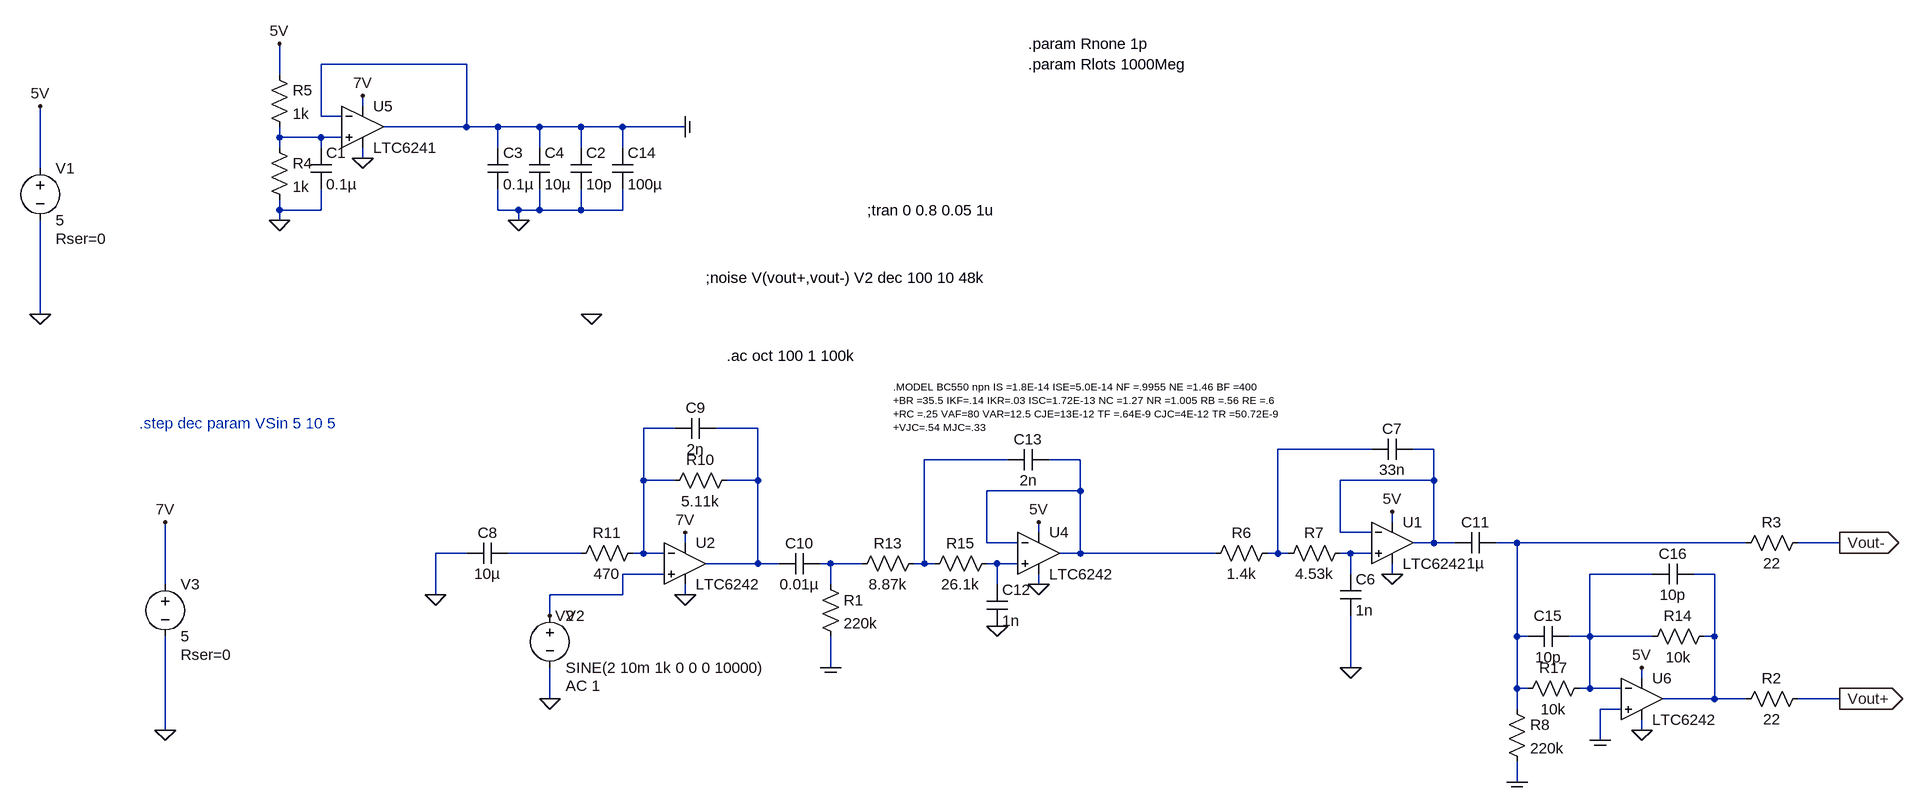
[diagram p0: schematic preampsimplified.asc]
preampsimplified.asc, the LTspice schematic file:
Version 4
SHEET 1 2944 1584
WIRE -192 -384 -416 -384
WIRE -480 -368 -480 -416
WIRE -352 -320 -352 -336
WIRE -416 -304 -416 -384
WIRE -384 -304 -416 -304
WIRE -192 -288 -192 -384
WIRE -192 -288 -320 -288
WIRE -144 -288 -192 -288
WIRE -80 -288 -144 -288
WIRE -16 -288 -80 -288
WIRE 48 -288 -16 -288
WIRE 144 -288 48 -288
WIRE -480 -272 -480 -288
WIRE -416 -272 -480 -272
WIRE -384 -272 -416 -272
WIRE -480 -256 -480 -272
WIRE -416 -256 -416 -272
WIRE -144 -256 -144 -288
WIRE -80 -256 -80 -288
WIRE -16 -256 -16 -288
WIRE 48 -256 48 -288
WIRE -352 -240 -352 -256
WIRE -848 -224 -848 -320
WIRE -480 -160 -480 -176
WIRE -416 -160 -416 -192
WIRE -416 -160 -480 -160
WIRE -144 -160 -144 -192
WIRE -112 -160 -144 -160
WIRE -80 -160 -80 -192
WIRE -80 -160 -112 -160
WIRE -16 -160 -16 -192
WIRE -16 -160 -80 -160
WIRE 48 -160 48 -192
WIRE 48 -160 -16 -160
WIRE -480 -144 -480 -160
WIRE -112 -144 -112 -160
WIRE -848 0 -848 -144
WIRE 128 176 80 176
WIRE 256 176 192 176
WIRE 1200 208 1056 208
WIRE 1296 208 1264 208
WIRE 640 224 512 224
WIRE 752 224 704 224
WIRE 80 256 80 176
WIRE 128 256 80 256
WIRE 256 256 256 176
WIRE 256 256 208 256
WIRE 1296 256 1296 208
WIRE 1296 256 1152 256
WIRE 752 272 752 224
WIRE 752 272 608 272
WIRE 1232 320 1232 304
WIRE 688 336 688 320
WIRE 1152 336 1152 256
WIRE 1200 336 1152 336
WIRE 144 352 144 336
WIRE 608 352 608 272
WIRE 656 352 608 352
WIRE 1296 352 1296 256
WIRE 1296 352 1264 352
WIRE 1328 352 1296 352
WIRE 1424 352 1392 352
WIRE 1776 352 1424 352
WIRE 1920 352 1856 352
WIRE -192 368 -240 368
WIRE -16 368 -128 368
WIRE 80 368 80 256
WIRE 80 368 64 368
WIRE 112 368 80 368
WIRE 752 368 752 272
WIRE 752 368 720 368
WIRE 960 368 752 368
WIRE 1056 368 1056 208
WIRE 1056 368 1040 368
WIRE 1072 368 1056 368
WIRE 1168 368 1152 368
WIRE 1200 368 1168 368
WIRE 256 384 256 256
WIRE 256 384 176 384
WIRE 288 384 256 384
WIRE 368 384 352 384
WIRE 416 384 368 384
WIRE 512 384 512 224
WIRE 512 384 496 384
WIRE 528 384 512 384
WIRE 624 384 608 384
WIRE 656 384 624 384
WIRE 112 400 48 400
WIRE 1168 400 1168 368
WIRE 1232 400 1232 384
WIRE 1632 400 1536 400
WIRE 1728 400 1696 400
WIRE -656 416 -656 320
WIRE 368 416 368 384
WIRE 624 416 624 384
WIRE 688 416 688 400
WIRE 688 416 672 416
WIRE -240 432 -240 368
WIRE 48 432 48 400
WIRE 48 432 -64 432
WIRE 144 432 144 416
WIRE -64 464 -64 432
WIRE 1424 496 1424 352
WIRE 1440 496 1424 496
WIRE 1536 496 1536 400
WIRE 1536 496 1504 496
WIRE 1632 496 1536 496
WIRE 1728 496 1728 400
WIRE 1728 496 1712 496
WIRE 368 544 368 496
WIRE 1168 544 1168 464
WIRE 1616 560 1616 544
WIRE 1424 576 1424 496
WIRE 1440 576 1424 576
WIRE 1536 576 1536 496
WIRE 1536 576 1520 576
WIRE 1584 576 1536 576
WIRE -64 592 -64 544
WIRE 1728 592 1728 496
WIRE 1728 592 1648 592
WIRE 1776 592 1728 592
WIRE 1920 592 1856 592
WIRE 1424 608 1424 576
WIRE 1584 608 1552 608
WIRE -656 640 -656 496
WIRE 1616 640 1616 624
WIRE 1552 656 1552 608
WIRE 1424 720 1424 688
FLAG -64 592 0
FLAG -848 0 0
FLAG -848 -320 5V
FLAG -480 -144 0
FLAG -480 -416 5V
FLAG 144 -288 COM
FLAG -64 464 V2
FLAG -112 -144 0
FLAG 1552 656 COM
FLAG 1616 544 5V
FLAG 1616 640 0
FLAG 1920 592 Vout+
IOPIN 1920 592 Out
FLAG 1920 352 Vout-
IOPIN 1920 352 Out
FLAG 144 336 7V
FLAG 144 432 0
FLAG 1232 400 0
FLAG 1232 304 5V
FLAG 688 416 0
FLAG 688 320 5V
FLAG -656 640 0
FLAG -656 320 7V
FLAG 368 544 COM
FLAG -352 -336 7V
FLAG -352 -240 0
FLAG 1424 720 COM
FLAG 624 480 0
FLAG 1168 544 0
FLAG -240 432 0
FLAG 0 0 0
SYMBOL voltage -848 -240 R0
WINDOW 123 0 0 Left 2
WINDOW 39 24 124 Left 2
SYMATTR SpiceLine Rser=0
SYMATTR InstName V1
SYMATTR Value 5
SYMBOL voltage -64 448 R0
WINDOW 123 24 124 Left 2
WINDOW 39 24 152 Left 2
SYMATTR Value2 AC 1
SYMATTR InstName V2
SYMATTR Value SINE(2 10m 1k 0 0 0 10000)
SYMBOL res -496 -272 R0
SYMATTR InstName R4
SYMATTR Value 1k
SYMBOL res -496 -384 R0
SYMATTR InstName R5
SYMATTR Value 1k
SYMBOL cap -160 -256 R0
SYMATTR InstName C3
SYMATTR Value 0.1µ
SYMBOL cap -96 -256 R0
SYMATTR InstName C4
SYMATTR Value 10µ
SYMBOL res 1616 512 R270
WINDOW 0 32 56 VTop 2
WINDOW 3 0 56 VBottom 2
SYMATTR InstName R14
SYMATTR Value 10k
SYMBOL res 1424 592 R270
WINDOW 0 32 56 VTop 2
WINDOW 3 0 56 VBottom 2
SYMATTR InstName R17
SYMATTR Value 10k
SYMBOL cap -432 -256 R0
SYMATTR InstName C1
SYMATTR Value 0.1µ
SYMBOL cap -32 -256 R0
SYMATTR InstName C2
SYMATTR Value 10p
SYMBOL res 1760 608 R270
WINDOW 0 32 56 VTop 2
WINDOW 3 0 56 VBottom 2
SYMATTR InstName R2
SYMATTR Value 22
SYMBOL res 1760 368 R270
WINDOW 0 32 56 VTop 2
WINDOW 3 0 56 VBottom 2
SYMATTR InstName R3
SYMATTR Value 22
SYMBOL res 112 272 R270
WINDOW 0 32 56 VTop 2
WINDOW 3 0 56 VBottom 2
SYMATTR InstName R10
SYMATTR Value 5.11k
SYMBOL res -32 384 R270
WINDOW 0 32 56 VTop 2
WINDOW 3 0 56 VBottom 2
SYMATTR InstName R11
SYMATTR Value 470
SYMBOL Opamps\\LTC6242 1232 352 R0
SYMATTR InstName U1
SYMBOL Opamps\\LTC6242 1616 592 R0
SYMATTR InstName U6
SYMBOL res 1056 352 R90
WINDOW 0 0 56 VBottom 2
WINDOW 3 32 56 VTop 2
SYMATTR InstName R6
SYMATTR Value 1.4k
SYMBOL res 1168 352 R90
WINDOW 0 0 56 VBottom 2
WINDOW 3 32 56 VTop 2
SYMATTR InstName R7
SYMATTR Value 4.53k
SYMBOL cap 1152 400 R0
SYMATTR InstName C6
SYMATTR Value 1n
SYMBOL cap 1264 192 R90
WINDOW 0 0 32 VBottom 2
WINDOW 3 32 32 VTop 2
SYMATTR InstName C7
SYMATTR Value 33n
SYMBOL Opamps\\LTC6242 688 368 R0
SYMATTR InstName U4
SYMBOL res 512 368 R90
WINDOW 0 0 56 VBottom 2
WINDOW 3 32 56 VTop 2
SYMATTR InstName R13
SYMATTR Value 8.87k
SYMBOL res 624 368 R90
WINDOW 0 0 56 VBottom 2
WINDOW 3 32 56 VTop 2
SYMATTR InstName R15
SYMATTR Value 26.1k
SYMBOL cap 608 416 R0
SYMATTR InstName C12
SYMATTR Value 1n
SYMBOL cap 704 208 R90
WINDOW 0 0 32 VBottom 2
WINDOW 3 32 32 VTop 2
SYMATTR InstName C13
SYMATTR Value 2n
SYMBOL cap 192 160 R90
WINDOW 0 0 32 VBottom 2
WINDOW 3 32 32 VTop 2
SYMATTR InstName C9
SYMATTR Value 2n
SYMBOL voltage -656 400 R0
WINDOW 123 0 0 Left 2
WINDOW 39 24 124 Left 2
SYMATTR SpiceLine Rser=0
SYMATTR InstName V3
SYMATTR Value 5
SYMBOL cap 288 400 R270
WINDOW 0 32 32 VTop 2
WINDOW 3 0 32 VBottom 2
SYMATTR InstName C10
SYMATTR Value 0.01µ
SYMBOL cap 1328 368 R270
WINDOW 0 32 32 VTop 2
WINDOW 3 0 32 VBottom 2
SYMATTR InstName C11
SYMATTR Value 1µ
SYMBOL res 352 400 R0
SYMATTR InstName R1
SYMATTR Value 220k
SYMBOL Opamps\\LTC6241 -352 -288 R0
SYMATTR InstName U5
SYMBOL res 1408 592 R0
SYMATTR InstName R8
SYMATTR Value 220k
SYMBOL cap 32 -256 R0
SYMATTR InstName C14
SYMATTR Value 100µ
SYMATTR SpiceLine Rser=900m
SYMBOL cap 1504 480 R90
WINDOW 0 0 32 VBottom 2
WINDOW 3 32 32 VTop 2
SYMATTR InstName C15
SYMATTR Value 10p
SYMBOL cap 1696 384 R90
WINDOW 0 0 32 VBottom 2
WINDOW 3 32 32 VTop 2
SYMATTR InstName C16
SYMATTR Value 10p
SYMBOL cap -192 384 R270
WINDOW 0 32 32 VTop 2
WINDOW 3 0 32 VBottom 2
SYMATTR InstName C8
SYMATTR Value 10µ
SYMBOL Opamps\\LTC6242 144 384 R0
SYMATTR InstName U2
TEXT 424 -160 Left 2 !;tran 0 0.8 0.05 1u
TEXT 176 -56 Left 2 !;noise V(vout+,vout-) V2 dec 100 10 48k
TEXT 208 64 Left 2 !.ac oct 100 1 100k
TEXT 464 112 Left 1 !.MODEL BC550 npn IS =1.8E-14 ISE=5.0E-14 NF =.9955 NE =1.46 BF =400\n+BR =35.5 IKF=.14 IKR=.03 ISC=1.72E-13 NC =1.27 NR =1.005 RB =.56 RE =.6\n+RC =.25 VAF=80 VAR=12.5 CJE=13E-12 TF =.64E-9 CJC=4E-12 TR =50.72E-9\n+VJC=.54 MJC=.33
TEXT 672 -416 Left 2 !.param Rnone 1p
TEXT 672 -384 Left 2 !.param Rlots 1000Meg
TEXT -696 168 Left 2 ;.step dec param VSin 5 10 5

The netlist it stands for:
* preampsimplified.asc
V1 5V 0 5 Rser=0
V2 V2 0 SINE(2 10m 1k 0 0 0 10000) AC 1
R4 N001 0 1k
R5 5V N001 1k
C3 COM 0 0.1µ
C4 COM 0 10µ
R14 N013 N014 10k
R17 N008 N013 10k
C1 N001 0 0.1µ
C2 COM 0 10p
R2 N014 Vout+ 22
R3 N008 Vout- 22
R10 N002 N003 5.11k
R11 N009 N002 470
* U1: LTC6242 (symbol Opamps\LTC6242 not available, pins judged from their places): In+=N010 In-=N005 V+=5V V-=0 OUT=N005
* U6: LTC6242 (symbol Opamps\LTC6242 not available, pins judged from their places): In+=COM In-=N013 V+=5V V-=0 OUT=N014
R6 N004 N007 1.4k
R7 N010 N004 4.53k
C6 N010 0 1n
C7 N005 N004 33n
* U4: LTC6242 (symbol Opamps\LTC6242 not available, pins judged from their places): In+=N012 In-=N007 V+=5V V-=0 OUT=N007
R13 N006 N011 8.87k
R15 N012 N006 26.1k
C12 N012 0 1n
C13 N007 N006 2n
C9 N003 N002 2n
V3 7V 0 5 Rser=0
C10 N003 N011 0.01µ
C11 N005 N008 1µ
R1 N011 COM 220k
XU5 N001 COM 7V 0 COM LTC6241  ; pins In+ In- V+ V- OUT
R8 N008 COM 220k
C14 COM 0 100µ Rser=900m
C15 N013 N008 10p
C16 N014 N013 10p
C8 0 N009 10µ
* U2: LTC6242 (symbol Opamps\LTC6242 not available, pins judged from their places): In+=V2 In-=N002 V+=7V V-=0 OUT=N003
;tran 0 0.8 0.05 1u
;noise V(vout+,vout-) V2 dec 100 10 48k
.ac oct 100 1 100k
.MODEL BC550 npn IS =1.8E-14 ISE=5.0E-14 NF =.9955 NE =1.46 BF =400
+BR =35.5 IKF=.14 IKR=.03 ISC=1.72E-13 NC =1.27 NR =1.005 RB =.56 RE =.6
+RC =.25 VAF=80 VAR=12.5 CJE=13E-12 TF =.64E-9 CJC=4E-12 TR =50.72E-9
+VJC=.54 MJC=.33
.param Rnone 1p
.param Rlots 1000Meg
* .step dec param VSin 5 10 5
.lib LTC4.lib
.backanno
.end